# EAGLE design lightmeter_3 (EAGLE 9.6.2)
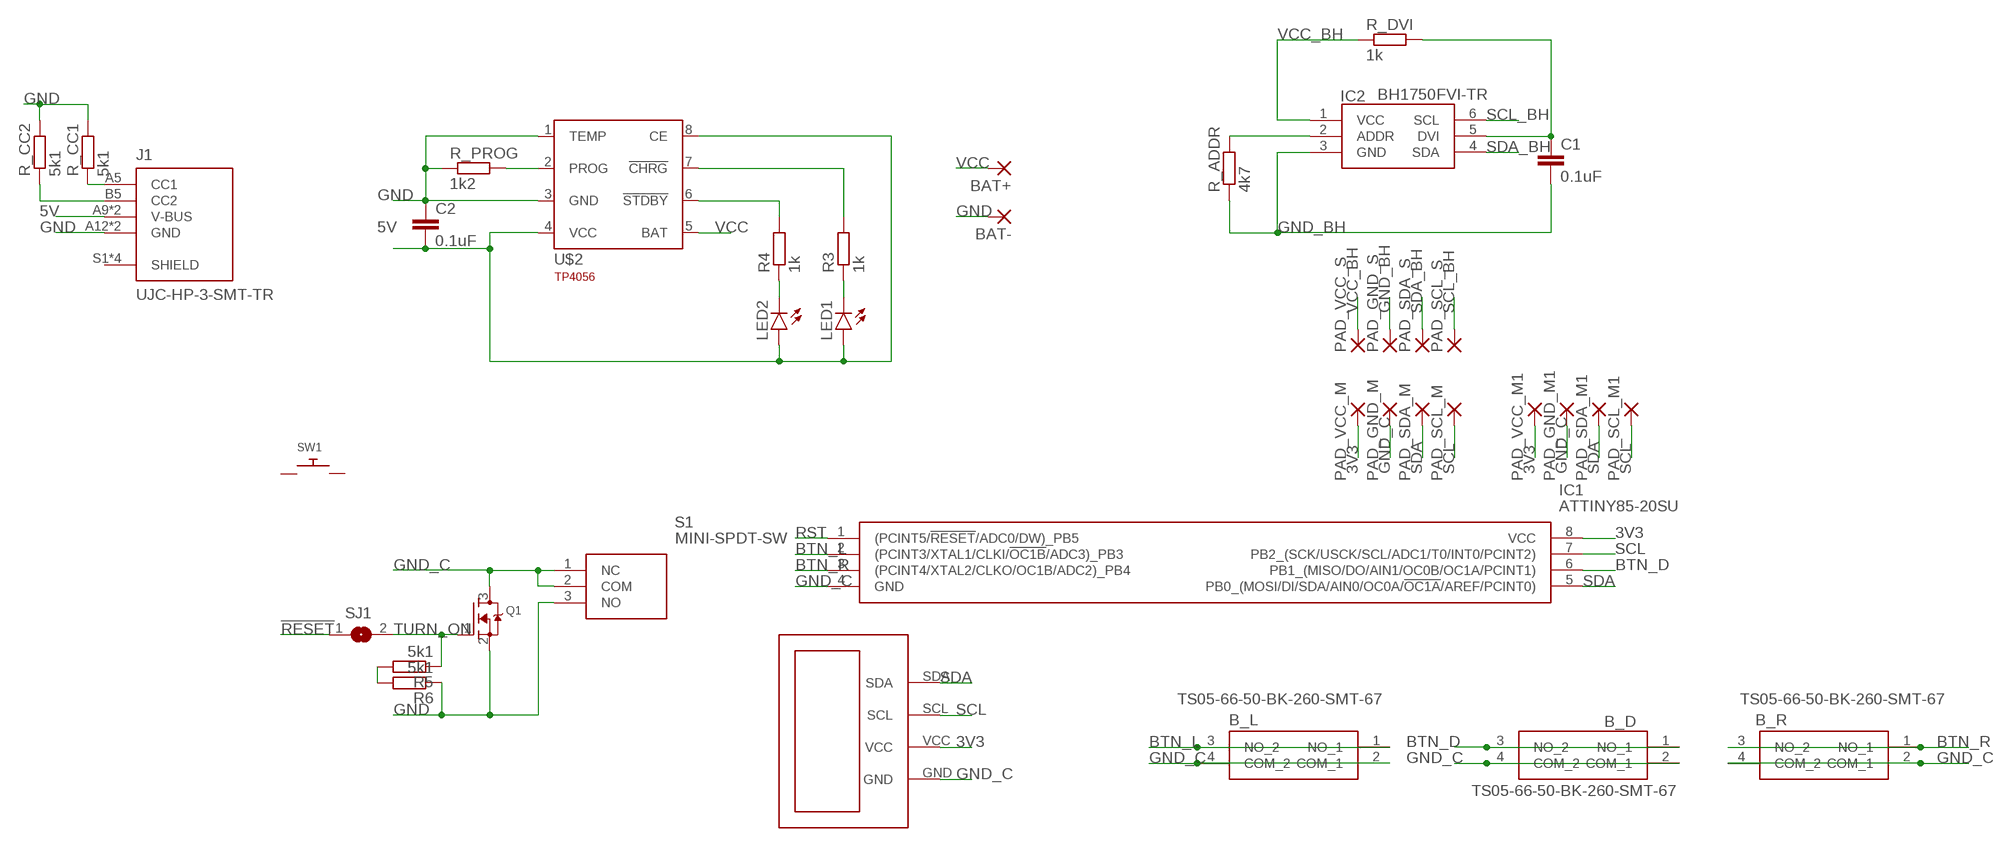
[diagram p0: schematic, sheet 1]

## Parts
B_D  TS05-66-50-BK-260-SMT-67  [TS056650BK260SMT67]
B_L  TS05-66-50-BK-260-SMT-67  [TS056650BK260SMT67]
B_R  TS05-66-50-BK-260-SMT-67  [TS056650BK260SMT67]
BAT+  WIREPADSMD1,27-254  [SMD1,27-2,54]
BAT-  WIREPADSMD1,27-254  [SMD1,27-2,54]
C1  0.1uF  C-EUC0805K  [C0805K]
C2  0.1uF  C-EUC0805K  [C0805K]
IC1  ATTINY85-20SU  [SOIC127P798X216-8N]
IC2  BH1750FVI-TR  [WSOF6]
J1  UJC-HP-3-SMT-TR  [CUI_UJC-HP-3-SMT-TR]
LED1  LEDCHIPLED_1206  [CHIPLED_1206]
LED2  LEDCHIPLED_1206  [CHIPLED_1206]
PAD_GND_M  SMD5  [SMD2,54-5,08]
PAD_GND_M1  SMD5  [SMD2,54-5,08]
PAD_GND_S  SMD5  [SMD2,54-5,08]
PAD_SCL_M  SMD5  [SMD2,54-5,08]
PAD_SCL_M1  SMD5  [SMD2,54-5,08]
PAD_SCL_S  SMD5  [SMD2,54-5,08]
PAD_SDA_M  SMD5  [SMD2,54-5,08]
PAD_SDA_M1  SMD5  [SMD2,54-5,08]
PAD_SDA_S  SMD5  [SMD2,54-5,08]
PAD_VCC_M  SMD5  [SMD2,54-5,08]
PAD_VCC_M1  SMD5  [SMD2,54-5,08]
PAD_VCC_S  SMD5  [SMD2,54-5,08]
Q1  MOSFET-NREFLOW  [SOT23]
R3  1k  R-EU_R0805  [R0805]
R4  1k  R-EU_R0805  [R0805]
R5  5k1  R-EU_R0805  [R0805]
R6  5k1  R-EU_R0805  [R0805]
R_ADDR  4k7  R-EU_R0805  [R0805]
R_CC1  5k1  R-EU_R0805  [R0805]
R_CC2  5k1  R-EU_R0805  [R0805]
R_DVI  1k  R-EU_R0805  [R0805]
R_PROG  1k2  R-EU_R0805  [R0805]
S1  MINI-SPDT-SW  [MINISPDTSW]
SJ1  SJ  [SJ]
SW1  SWITCH_PUSHBUTTONEVQ-PE  [TACT_PANA-EVQ]
U$1  I2C_OLED_128X64  [I2C_OLED_128X64_BREAKOUT]
U$2  TP4056  [SOT23-8]

## Nets
3V3: IC1.8(VCC) PAD_VCC_M1.1(P) PAD_VCC_M.1(P) U$1.VCC
5V: C2.2 J1.A9(V-BUS) J1.B9(V-BUS) LED1.A LED2.A U$2.4(VCC) U$2.8(CE)
!RESET: SJ1.1
BTN_D: B_D.1(NO_1) B_D.3(NO_2) IC1.6(PB1_(MISO/DO/AIN1/OC0B/OC1A/PCINT1))
BTN_L: B_L.1(NO_1) B_L.3(NO_2) IC1.2((PCINT3/XTAL1/CLKI/!OC1B!/ADC3)_PB3)
BTN_R: B_R.1(NO_1) B_R.3(NO_2) IC1.3((PCINT4/XTAL2/CLKO/OC1B/ADC2)_PB4)
GND: BAT-.1(P) C2.1 J1.A12(GND) J1.B12(GND) Q1.2(S) R6.1 R_CC1.2 R_CC2.2 R_PROG.1 S1.3(NO) U$2.1(TEMP) U$2.3(GND)
GND_BH: C1.2 IC2.3(GND) PAD_GND_S.1(P) R_ADDR.1
GND_C: B_D.2(COM_1) B_D.4(COM_2) B_L.2(COM_1) B_L.4(COM_2) B_R.2(COM_1) B_R.4(COM_2) IC1.4(GND) PAD_GND_M1.1(P) PAD_GND_M.1(P) Q1.3(D) S1.1(NC) S1.2(COM) U$1.GND
N$1: C1.1 IC2.5(DVI) R_DVI.2
N$2: IC2.2(ADDR) R_ADDR.2
N$3: J1.B5(CC2) R_CC2.1
N$4: R4.2 U$2.6(!STDBY)
N$5: R3.2 U$2.7(!CHRG)
N$6: LED2.C R4.1
N$7: LED1.C R3.1
N$8: J1.A5(CC1) R_CC1.1
N$9: R_PROG.2 U$2.2(PROG)
N$10: R5.2 R6.2
RST: IC1.1((PCINT5/!RESET!/ADC0/DW)_PB5)
SCL: IC1.7(PB2_(SCK/USCK/SCL/ADC1/T0/INT0/PCINT2)) PAD_SCL_M1.1(P) PAD_SCL_M.1(P) U$1.SCL
SCL_BH: IC2.6(SCL) PAD_SCL_S.1(P)
SDA: IC1.5(PB0_(MOSI/DI/SDA/AIN0/OC0A/!OC1A!/AREF/PCINT0)) PAD_SDA_M1.1(P) PAD_SDA_M.1(P) U$1.SDA
SDA_BH: IC2.4(SDA) PAD_SDA_S.1(P)
TURN_ON: Q1.1(G) R5.1 SJ1.2
VCC: BAT+.1(P) U$2.5(BAT)
VCC_BH: IC2.1(VCC) PAD_VCC_S.1(P) R_DVI.1
Unconnected: J1.S1(SHIELD) J1.S2(SHIELD) J1.S3(SHIELD) J1.S4(SHIELD) SW1.P$1 SW1.P$2

## Library data of the parts
B_D B_L B_R = SamacSys_Parts:TS05-66-50-BK-260-SMT-67: Tactile Switches 6 x 6 mm, 5 mm Act Height, 260 gf, Black, Surface Mount, IP67, SPST, Source: Datasheet <https://www.cuidevices.com/product/resource/ts05.pdf>; DESCRIPTION: Tactile Switches 6 x 6 mm, 5 mm Act Height, 260 gf, Black, Surface Mount, IP67, SPST,; HEIGHT: 5.2mm; MANUFACTURER_NAME: CUI Inc.; MANUFACTURER_PART_NUMBER: TS05-66-50-BK-260-SMT-67; MOUSER_PART_NUMBER: 179-TS056650260SMT67; MOUSER_PRICE-STOCK: https://www.mouser.co.uk/ProductDetail/CUI-Devices/TS05-66-50-BK-260-SMT-67?qs=A6eO%252BMLsxmTTpMlvA87NHQ%3D%3D
BAT+ BAT- = wirepad:WIREPAD: Wire PAD connect wire on PCB
C1 C2 = rcl:C-EU: CAPACITOR, European symbol; SPICEPREFIX: C
IC1 = SamacSys_Parts:ATTINY85-20SU: MICROCHIP - ATTINY85-20SU - MICROCONTROLLER MCU, 8 BIT, ATTINY, 20MHZ, SOIC-8 Source: Datasheet <https://componentsearchengine.com/Datasheets/2/ATTINY85-20SU.pdf>; DESCRIPTION: MICROCHIP - ATTINY85-20SU - MICROCONTROLLER MCU, 8 BIT, ATTINY, 20MHZ, SOIC-8; HEIGHT: 2.16mm; MANUFACTURER_NAME: Microchip; MANUFACTURER_PART_NUMBER: ATTINY85-20SU; MOUSER_PART_NUMBER: 556-ATTINY85-20SU; MOUSER_PRICE-STOCK: https://www.mouser.co.uk/ProductDetail/Microchip-Technology-Atmel/ATTINY85-20SU?qs=8jWQYweyg6N%2FGXnwAe4Icw%3D%3D
IC2 = SamacSys_Parts:BH1750FVI-TR: Ambient Light Sensor,16bit,I2C,WSOF6I ROHM BH1750FVI-TR Ambient Light Sensor Unit Surface Mount Source: Datasheet <https://componentsearchengine.com/Datasheets/2/BH1750FVI-TR.pdf>; DESCRIPTION: Ambient Light Sensor,16bit,I2C,WSOF6I ROHM BH1750FVI-TR Ambient Light Sensor Unit Surface Mount; HEIGHT: mm; MANUFACTURER_NAME: ROHM Semiconductor; MANUFACTURER_PART_NUMBER: BH1750FVI-TR; MOUSER_PART_NUMBER: 755-BH1750FVI-TR; MOUSER_PRICE-STOCK: https://www.mouser.co.uk/ProductDetail/ROHM-Semiconductor/BH1750FVI-TR?qs=phc6PQ%252BTPUNy88lRCs6mVA%3D%3D
J1 = UJC-HP-3-SMT-TR:UJC-HP-3-SMT-TR: Type C, 3 A, Right Angle, Surface Mount (SMT), Power-Only USB Receptacle Check availability <https://pricing.snapeda.com/parts/UJC-HP-3-SMT-TR/CUI%20Devices/view-part?ref=eda>; AVAILABILITY: In Stock; CUI_PURCHASE_URL: https://www.cuidevices.com/product/interconnect/connectors/usb-connectors/ujc-hp-3-smt-tr?utm_source=snapeda.com&utm_medium=referral&utm_campaign=snapedaBOM; DESCRIPTION: Type C, 3 A, Right Angle, Surface Mount (SMT), Power-Only USB Receptacle; MF: CUI Devices; MP: UJC-HP-3-SMT-TR; PACKAGE: None; PRICE: None; PURCHASE-URL: https://pricing.snapeda.com/search/part/UJC-HP-3-SMT-TR/?ref=eda
LED1 LED2 = led:LED: LED OSRAM: - CHIPLED LG R971, LG N971, LY N971, LG Q971, LY Q971, LO R971, LY R971 LH N974, LH R974 LS Q976, LO Q976, LY Q976 LO Q996 - Hyper CHIPLED LW Q18S LB Q993, LB Q99A, LB R99A - SideLED LS A670, LO A670, LY A670, LG A670, LP A670 LB A673, LV A673, LT A673, LW A673 LH A674 LY A675 LS A676, LA A676, LO A676, LY A676, LW A676 LS A679, LY A679, LG A679 - Hyper Micro SIDELED® LS Y876, LA Y876, LO Y876, LY Y876 LT Y87S - SmartLED LW L88C, LW L88S LB L89C, LB L89S, LG L890 LS L89K, LO L89K, LY L89K LS L896, LA L896, LO L896, LY L896 - TOPLED LS T670, LO T670, LY T670, LG T670, LP T670 LSG T670, LSP T670, LSY T670, LOP T670, LYG T670 LG T671, LOG T671, LSG T671 LB T673, LV T673, LT T673, LW T673 LH T674 LS T676, LA T676, LO T676, LY T676, LB T676, LH T676, LSB T676, LW T676 LB T67C, LV T67C, LT T67C, LS T67K, LO T67K, LY T67K, LW E67C LS E67B, LA E67B, LO E67B, LY E67B, LB E67C, LV E67C, LT E67C LW T67C LS T679, LY T679, LG T679 LS T770, LO T770, LY T770, LG T770, LP T770 LB T773, LV T773, LT T773, LW T773 LH T774 LS E675, LA E675, LY E675, LS T675 LS T776, LA T776, LO T776, LY T776, LB T776 LHGB T686 LT T68C, LB T68C - Hyper Mini TOPLED® LB M676 - Mini TOPLED Santana® LG M470 LS M47K, LO M47K, LY M47K Source: http://www.osram.convergy.de LUXEON: - LUMILED® LXK2-PW12-R00, LXK2-PW12-S00, LXK2-PW14-U00, LXK2-PW14-V00 LXK2-PM12-R00, LXK2-PM12-S00, LXK2-PM14-U00 LXK2-PE12-Q00, LXK2-PE12-R00, LXK2-PE12-S00, LXK2-PE14-T00, LXK2-PE14-U00 LXK2-PB12-K00, LXK2-PB12-L00, LXK2-PB12-M00, LXK2-PB14-N00, LXK2-PB14-P00, LXK2-PB14-Q00 LXK2-PR12-L00, LXK2-PR12-M00, LXK2-PR14-Q00, LXK2-PR14-R00 LXK2-PD12-Q00, LXK2-PD12-R00, LXK2-PD12-S00 LXK2-PH12-R00, LXK2-PH12-S00 LXK2-PL12-P00, LXK2-PL12-Q00, LXK2-PL12-R00 Source: www.luxeon.com KINGBRIGHT: KA-3528ASYC Source: www.kingbright.com
PAD_GND_M PAD_GND_M1 PAD_GND_S PAD_SCL_M PAD_SCL_M1 PAD_SCL_S PAD_SDA_M PAD_SDA_M1 PAD_SDA_S PAD_VCC_M PAD_VCC_M1 PAD_VCC_S = wirepad:SMD5: SMD PAD
Q1 = adafruit:MOSFET-N: N-Channel Mosfet 2N7002E - 60V 260mA SOT23 [Digikey: 2N7002ET1GOSTR-ND] - REEL BSH103 - 30V 850mA SOT23 [Digikey: 568-5013-1-ND]
R3-R6 R_ADDR R_CC1 R_CC2 R_DVI R_PROG = rcl:R-EU_: RESISTOR, European symbol; SPICEPREFIX: R
S1 = SamacSys_Parts:MINI-SPDT-SW: Slide Switches MINI SPDT SWITCH Source: Datasheet <http://site.gravitech.us/Components/MINI-SPDT-SW/EG1218_datasheet.pdf>; DESCRIPTION: Slide Switches MINI SPDT SWITCH; HEIGHT: mm; MANUFACTURER_NAME: Gravitech; MANUFACTURER_PART_NUMBER: MINI-SPDT-SW; MOUSER_PART_NUMBER: 992-MINI-SPDT-SW; MOUSER_PRICE-STOCK: https://www.mouser.co.uk/ProductDetail/Gravitech/MINI-SPDT-SW?qs=Vxac6xGyzPm8ENq695r3yA%3D%3D
SJ1 = jumper:SJ: SMD solder JUMPER
SW1 = adafruit:SWITCH_PUSHBUTTON: Buttons SOFTTOUCHSMD_SJ - Soft touch temporary push button (Super Junk Akihabara) Compatible with SKPMANE010 [Mouser: 688-SKPMAN] C&K_KSS = Digikey: KSS221GLFS
U$1 = my_breakouts:I2C_OLED_128X64
U$2 = tp4056:TP4056: TP4056 Data sheet <http://goo.gl/J7k8TF> Dave.Calaway Eagle Library <https://goo.gl/Muy1Tr>

## Board
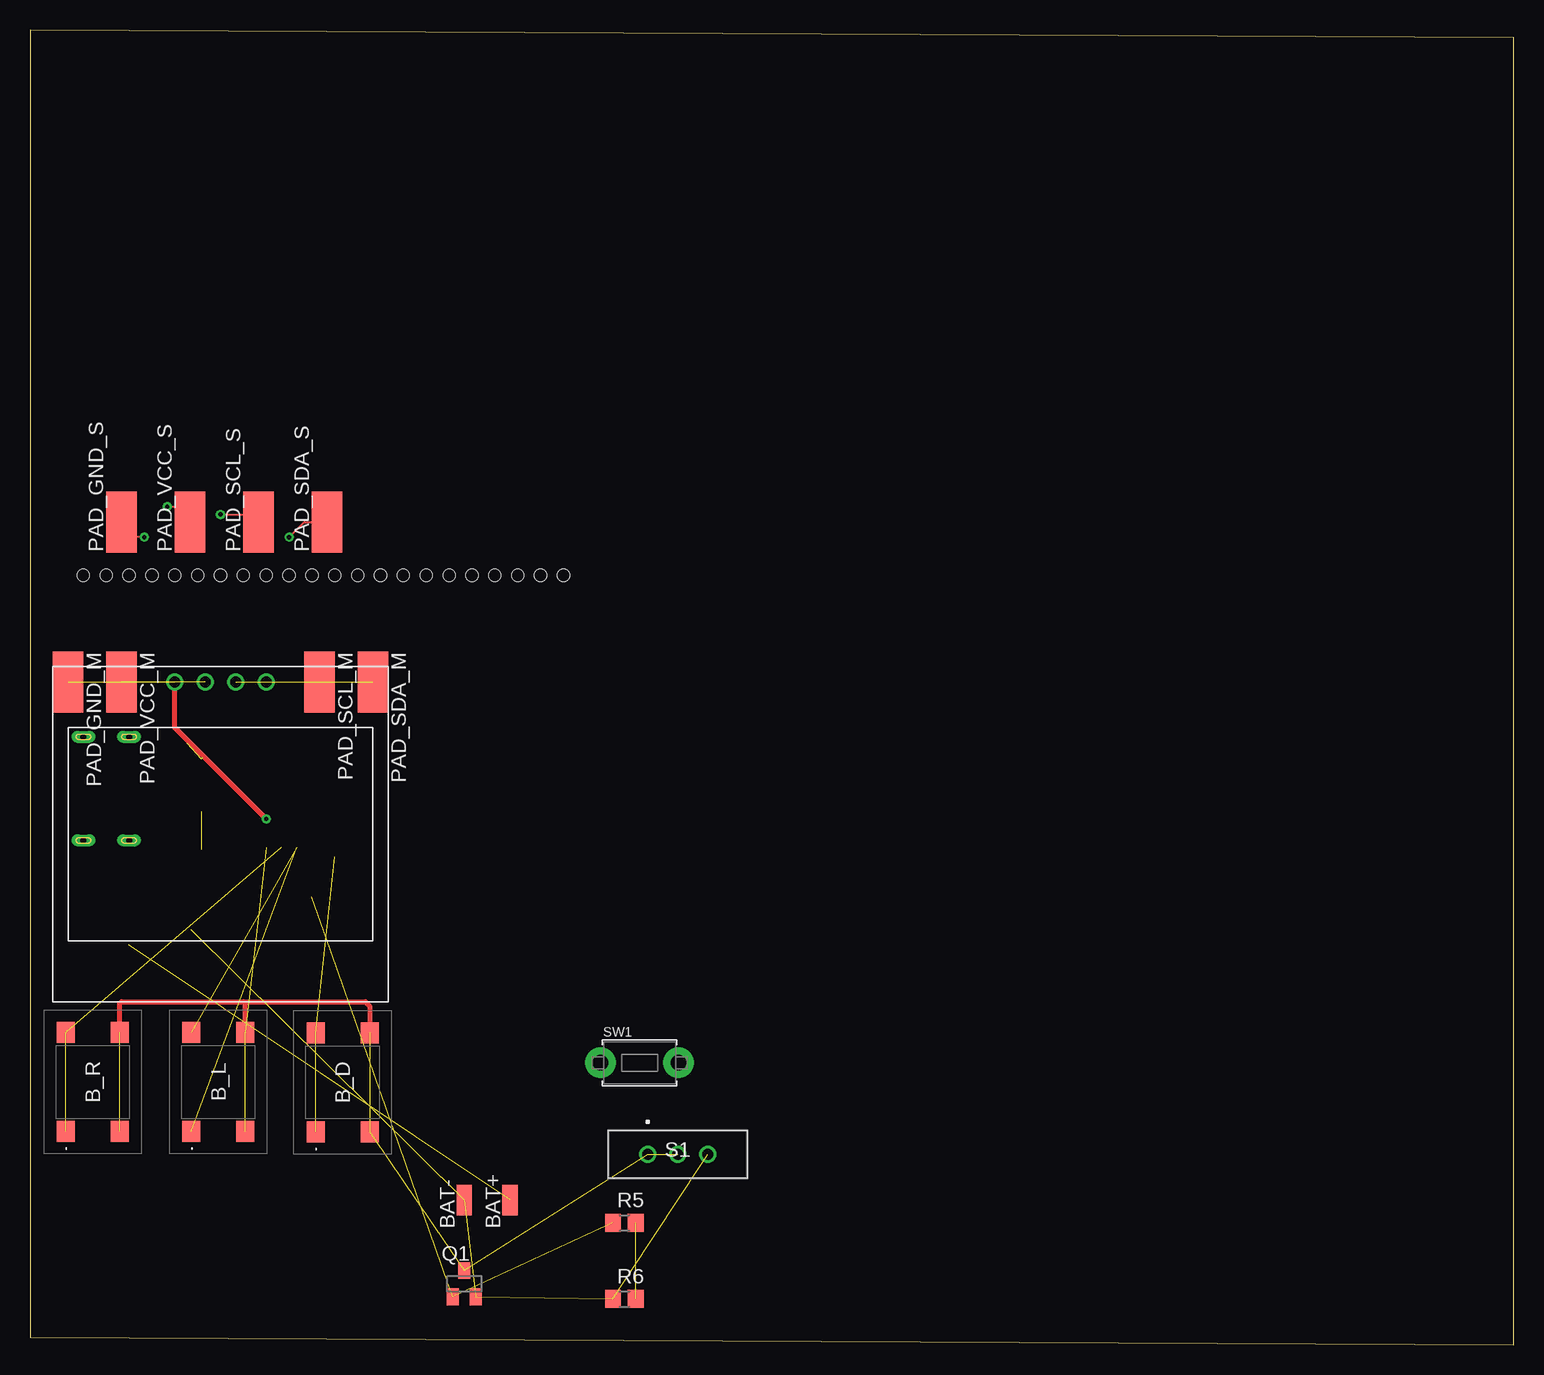
[diagram p1: board, top side]
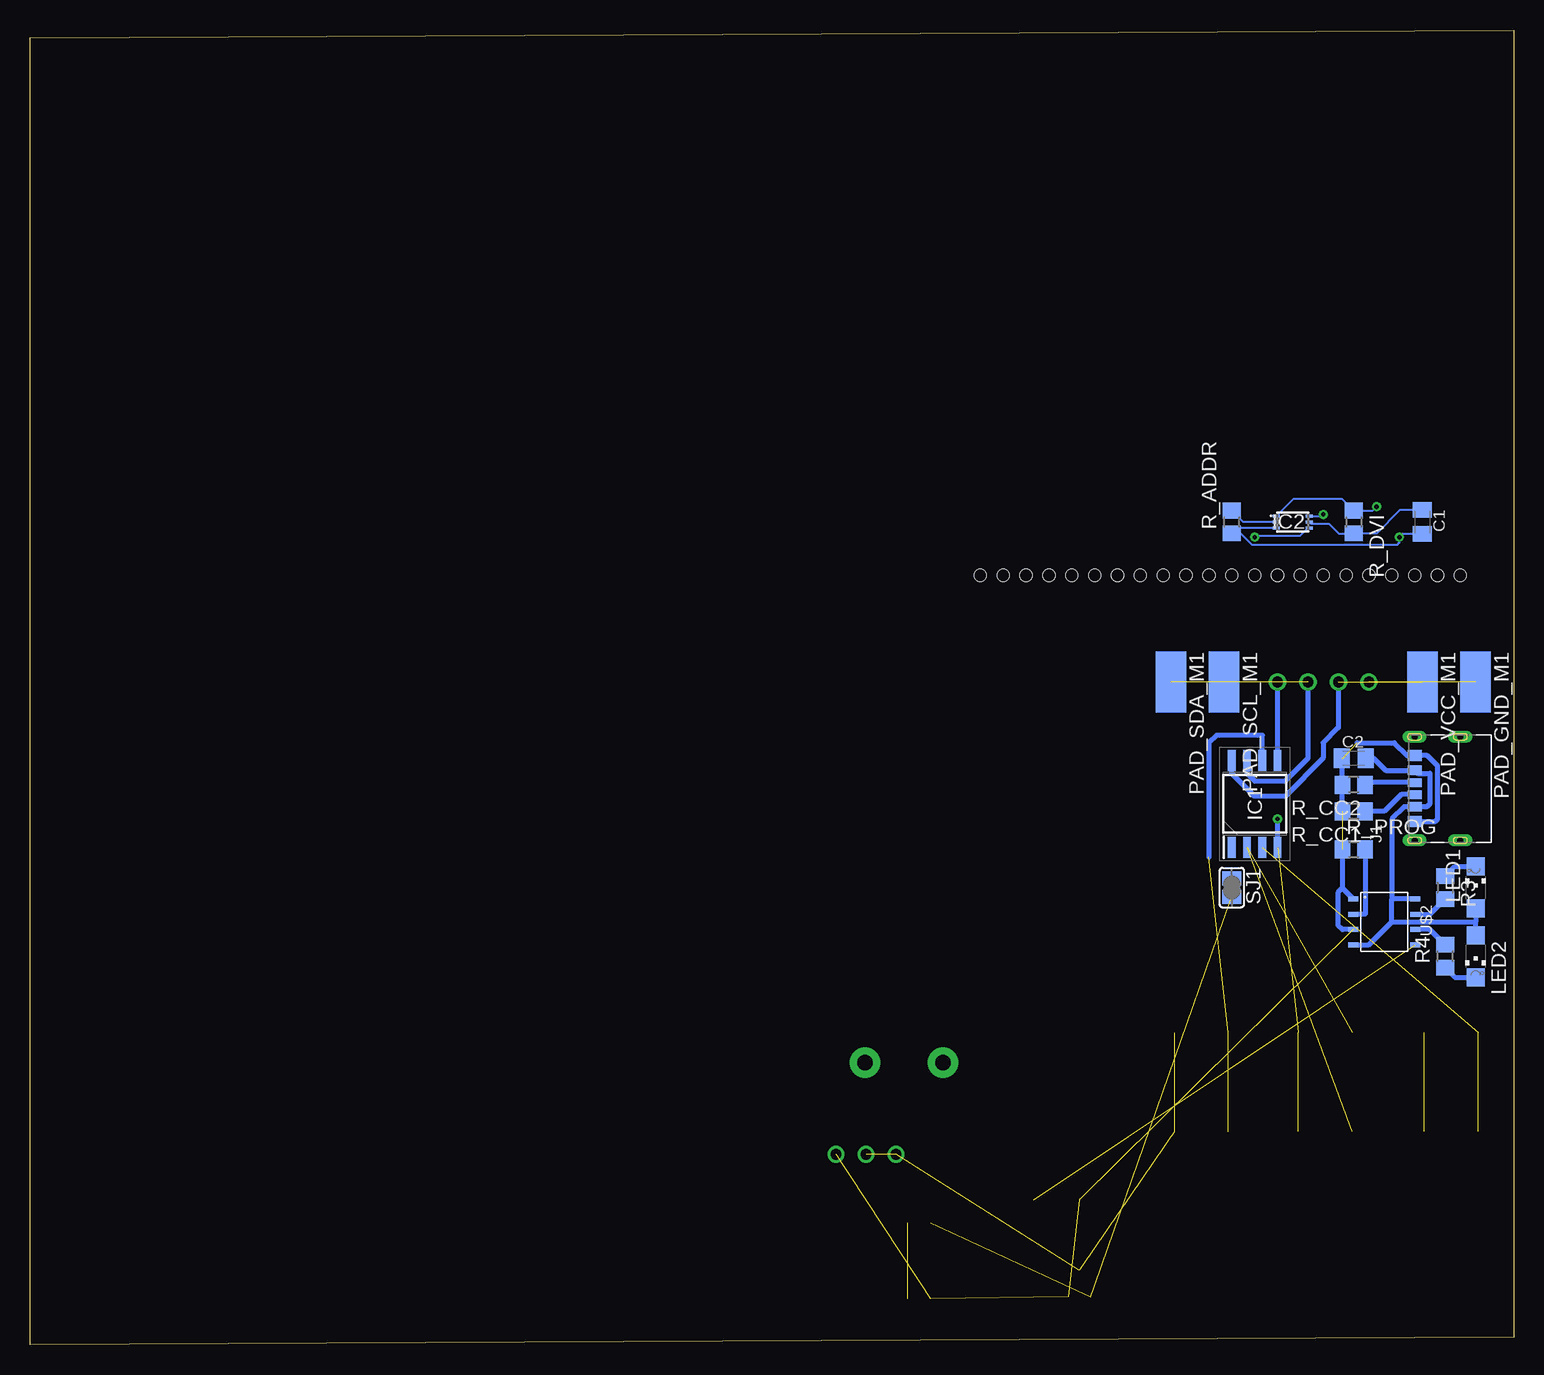
[diagram p2: board, bottom side, seen from below]

Size 123.64 x 109.59 mm. Coordinates in mm from the lower left corner, seen from the top.
Outline: 0,0.64 123.64,0 123.64,108.96 0,109.59 0,0.64
Copper layers (1*16): Top 0.035mm / dielectric 1.5mm / Bottom 0.035mm
Design rules "default": minimum track width 6mil, minimum drill 0.35mm, track to track 6mil, track to pad 6mil, pad to pad 6mil, via to via 6mil, smd to smd 6mil, copper to edge 40mil, drill to drill 6mil, minimum pad ring 10mil, minimum via ring 8mil, stop-mask expansion 4mil, vias tented up to drill 0mil, thermal gap 10mil
Holes 1 mm at 4.45,64.13 6.35,64.13 8.25,64.13 10.16,64.13 12.06,64.13 13.97,64.13 15.88,64.13 17.78,64.13 19.69,64.13 21.59,64.13 23.5,64.13 25.4,64.13 27.3,64.13 29.21,64.13 31.12,64.13 33.02,64.13 34.93,64.13 36.83,64.13 38.73,64.13 40.64,64.13 42.55,64.13 44.45,64.13

### Footprints (pad centres in the part's own frame; a part is rotated, then mirrored left to right if it is on the bottom)
TS056650BK260SMT67 = smd 1.75 x 1.5: 1 -4.125,2.25; 2 -4.125,-2.25; 3 4.125,2.25; 4 4.125,-2.25
SMD1,27-2,54 = smd 1.27 x 2.54: 1 0,0
C0805K = smd 1.3 x 1.6: 1 -1,0; 2 1,0
SOIC127P798X216-8N = smd 1.75 x 0.65: 1 -3.625,1.905; 2 -3.625,0.635; 3 -3.625,-0.635; 4 -3.625,-1.905; 5 3.625,-1.905; 6 3.625,-0.635; 7 3.625,0.635; 8 3.625,1.905
WSOF6 = smd 0.55 x 0.25: 1 -1.375,0.5; 2 -1.375,0; 3 -1.375,-0.5; 4 1.375,-0.5; 5 1.375,0; 6 1.375,0.5
CUI_UJC-HP-3-SMT-TR = smd 0.7 x 1.15: A5 -0.5,0.005; B5 0.5,0.005 | smd 0.8 x 1.15: A9 1.52,0.005; B9 -1.52,0.005 | smd 0.9 x 1.15: A12 2.75,0.005; B12 -2.75,0.005 | drill 0.5 pad 1 long: S1 -4.32,0; S2 4.32,0; S3 -4.32,-3.8; S4 4.32,-3.8
CHIPLED_1206 = smd 1.5 x 1.5: A 0,-1.75; C 0,1.75
SMD2,54-5,08 = smd 2.54 x 5.08: 1 0,0
SOT23 = smd 1 x 1.4: 1 -0.95,-1.1; 2 0.95,-1.1; 3 0,1.1
R0805 = smd 1.3 x 1.5: 1 -0.95,0; 2 0.95,0
MINISPDTSW = drill 0.9 pad 1.4: 1 -2.5,0; 2 0,0; 3 2.5,0
SJ = smd 1.168 x 1.6: 1 -0.762,0; 2 0.762,0
TACT_PANA-EVQ = drill 1.3 pad 2.54: P$1 -3.25,0; P$2 3.25,0
I2C_OLED_128X64_BREAKOUT = drill 0.9 pad 1.422: GND -10.16,1.27; SCL -15.24,1.27; SDA -17.78,1.27; VCC -12.7,1.27
SOT23-8 = smd 0.42 x 0.835: 1 -1.905,-2.58; 2 -0.635,-2.58; 3 0.635,-2.58; 4 1.905,-2.58; 5 1.905,2.58; 6 0.635,2.58; 7 -0.635,2.58; 8 -1.905,2.58

### Placement (x,y rotation side)
B_D  26.04,21.86 90 top
B_L  15.7,21.89 90 top
B_R  5.22,21.89 90 top
BAT+  40.01,12.06 0 top
BAT-  36.2,12.06 0 top
C1  7.62,68.58 270 bottom
C2  13.33,48.89 0 bottom
IC1  21.59,45.09 90 bottom
IC2  18.42,68.58 0 bottom
J1  8.25,46.35 90 bottom
LED1  3.17,38.1 0 bottom
LED2  3.17,32.38 180 bottom
PAD_GND_M  3.17,55.24 180 top
PAD_GND_M1  3.17,55.24 180 bottom
PAD_GND_S  7.62,68.58 0 top
PAD_SCL_M  24.13,55.24 180 top
PAD_SCL_M1  24.13,55.24 180 bottom
PAD_SCL_S  19.05,68.58 0 top
PAD_SDA_M  28.58,55.24 180 top
PAD_SDA_M1  28.58,55.24 180 bottom
PAD_SDA_S  24.77,68.58 0 top
PAD_VCC_M  7.62,55.24 180 top
PAD_VCC_M1  7.62,55.24 180 bottom
PAD_VCC_S  13.33,68.58 0 top
Q1  36.2,5.08 0 top
R3  5.71,38.1 270 bottom
R4  5.71,32.38 90 bottom
R5  49.53,10.16 0 top
R6  49.53,3.81 0 top
R_ADDR  23.5,68.58 90 bottom
R_CC1  13.33,44.45 180 bottom
R_CC2  13.33,46.67 180 bottom
R_DVI  13.33,68.58 270 bottom
R_PROG  13.33,41.27 0 bottom
S1  53.98,15.87 0 top
SJ1  23.5,38.1 270 bottom
SW1  50.8,23.5 0 top
U$1  1.91,56.52 180 top
U$2  10.79,35.24 270 bottom

### Tracks (layer width: path | path; a pad name or v marks a point on that pad's centre or on a via)
3V3  (2 unrouted)
  Bottom 0.406: U$1.VCC 14.6,51.43 15.88,50.16 15.88,48.89 19.05,45.72 21.59,45.72 23.5,47.62 IC1.8
5V
  Bottom 0.406: LED2.A 3.17,35.24 | LED1.A 3.17,35.24 | C2.2 11.7,48.89 10.68,47.88 J1.A9 8.01,47.62 6.99,47.62 6.99,45.09 7.24,44.84 J1.B9 9.14,44.84 10.16,43.81 10.16,37.15 | 10.16,35.24 3.17,35.24 | 10.16,35.24 10.16,37.15 | U$2.8 10.16,37.15 | U$2.4 12.06,33.34 10.16,35.24
BTN_D  (2 unrouted)
  Bottom 0.406: IC1.6 20.96,50.8 24.77,50.8 25.4,50.16 25.4,40.64
BTN_L  (2 unrouted)
BTN_R  (2 unrouted)
GND  (7 unrouted)
  Bottom 0.406: U$2.1 14.29,38.06 | R_PROG.1 14.29,38.06 | U$2.3 14.29,34.61 14.6,34.92 14.6,37.74 14.29,38.06 | J1.B12 8.33,43.53 | 8.15,43.5 J1.B12 | J1.B12 6.56,43.6 6.35,43.81 6.35,48.26 7.2,49.1 J1.A12 8.89,49.1 9.96,50.16 13.06,50.16 | R_CC1.2 R_CC2.2 14.29,48.84
GND_BH  (via drill 0.35)
  Top 0.152: v9.53,67.31 8.89,67.31 PAD_GND_S.1
  Bottom 0.152: IC2.3 23.05,68.08 R_ADDR.1 22.77,67.63 21.84,66.7 9.68,66.7 9.53,66.86 v9.53,67.31 9.25,67.58 C1.2
GND_C  (via drill 0.35)  (9 unrouted)
  Top 0.406: B_R.4 7.47,28.43 7.62,28.57 17.78,28.57 | 17.78,28.57 27.94,28.57 28.29,28.22 B_D.4 | B_L.4 17.95,28.41 17.78,28.57 | v19.69,43.81 12.06,51.43 U$1.GND
  Bottom 0.406: IC1.4 v19.69,43.81
N$1
  Bottom 0.152: IC2.5 16.89,68.43 15.4,68.43 14.6,67.63 R_DVI.2 11.43,67.63 9.48,69.58 C1.1
N$2
  Bottom 0.152: IC2.2 22.55,68.58 R_ADDR.2
N$3
  Bottom 0.406: J1.B5 12.2,46.85 R_CC2.1
N$4
  Bottom 0.406: R4.2 6.99,34.61 U$2.6
N$5
  Bottom 0.406: U$2.7 6.99,35.88 R3.2
N$6
  Bottom 0.406: R4.1 4.92,30.64 LED2.C
N$7
  Bottom 0.406: R3.1 4.92,39.85 LED1.C
N$8
  Bottom 0.406: J1.A5 9.39,45.85 10.79,44.45 R_CC1.1
N$9
  Bottom 0.406: R_PROG.2 12.38,35.88 U$2.2
N$10  (1 unrouted)
SCL  (2 unrouted)
  Bottom 0.406: IC1.7 22.23,47.62 21.59,46.99 19.05,46.99 17.14,48.89 U$1.SCL
SCL_BH  (via drill 0.35)
  Top 0.152: v15.88,69.22 18.42,69.22 PAD_SCL_S.1
  Bottom 0.152: IC2.6 15.88,69.08 v15.88,69.22
SDA  (2 unrouted)
  Bottom 0.406: IC1.5 U$1.SDA
SDA_BH  (via drill 0.35)
  Top 0.152: v21.59,67.31 22.86,68.58 PAD_SDA_S.1
  Bottom 0.152: v21.59,67.31 21.49,67.41 17.83,67.41 17.16,68.08 IC2.4
TURN_ON  (2 unrouted)
VCC  (1 unrouted)
VCC_BH  (via drill 0.35)
  Top 0.152: v11.43,69.85 12.06,69.85 PAD_VCC_S.1
  Bottom 0.152: IC2.1 18.39,70.48 14.29,70.48 R_DVI.1 11.75,69.53 v11.43,69.85